# EAGLE design TCC modulo de automação Wifi Rev.1   (EAGLE 8.2.1)
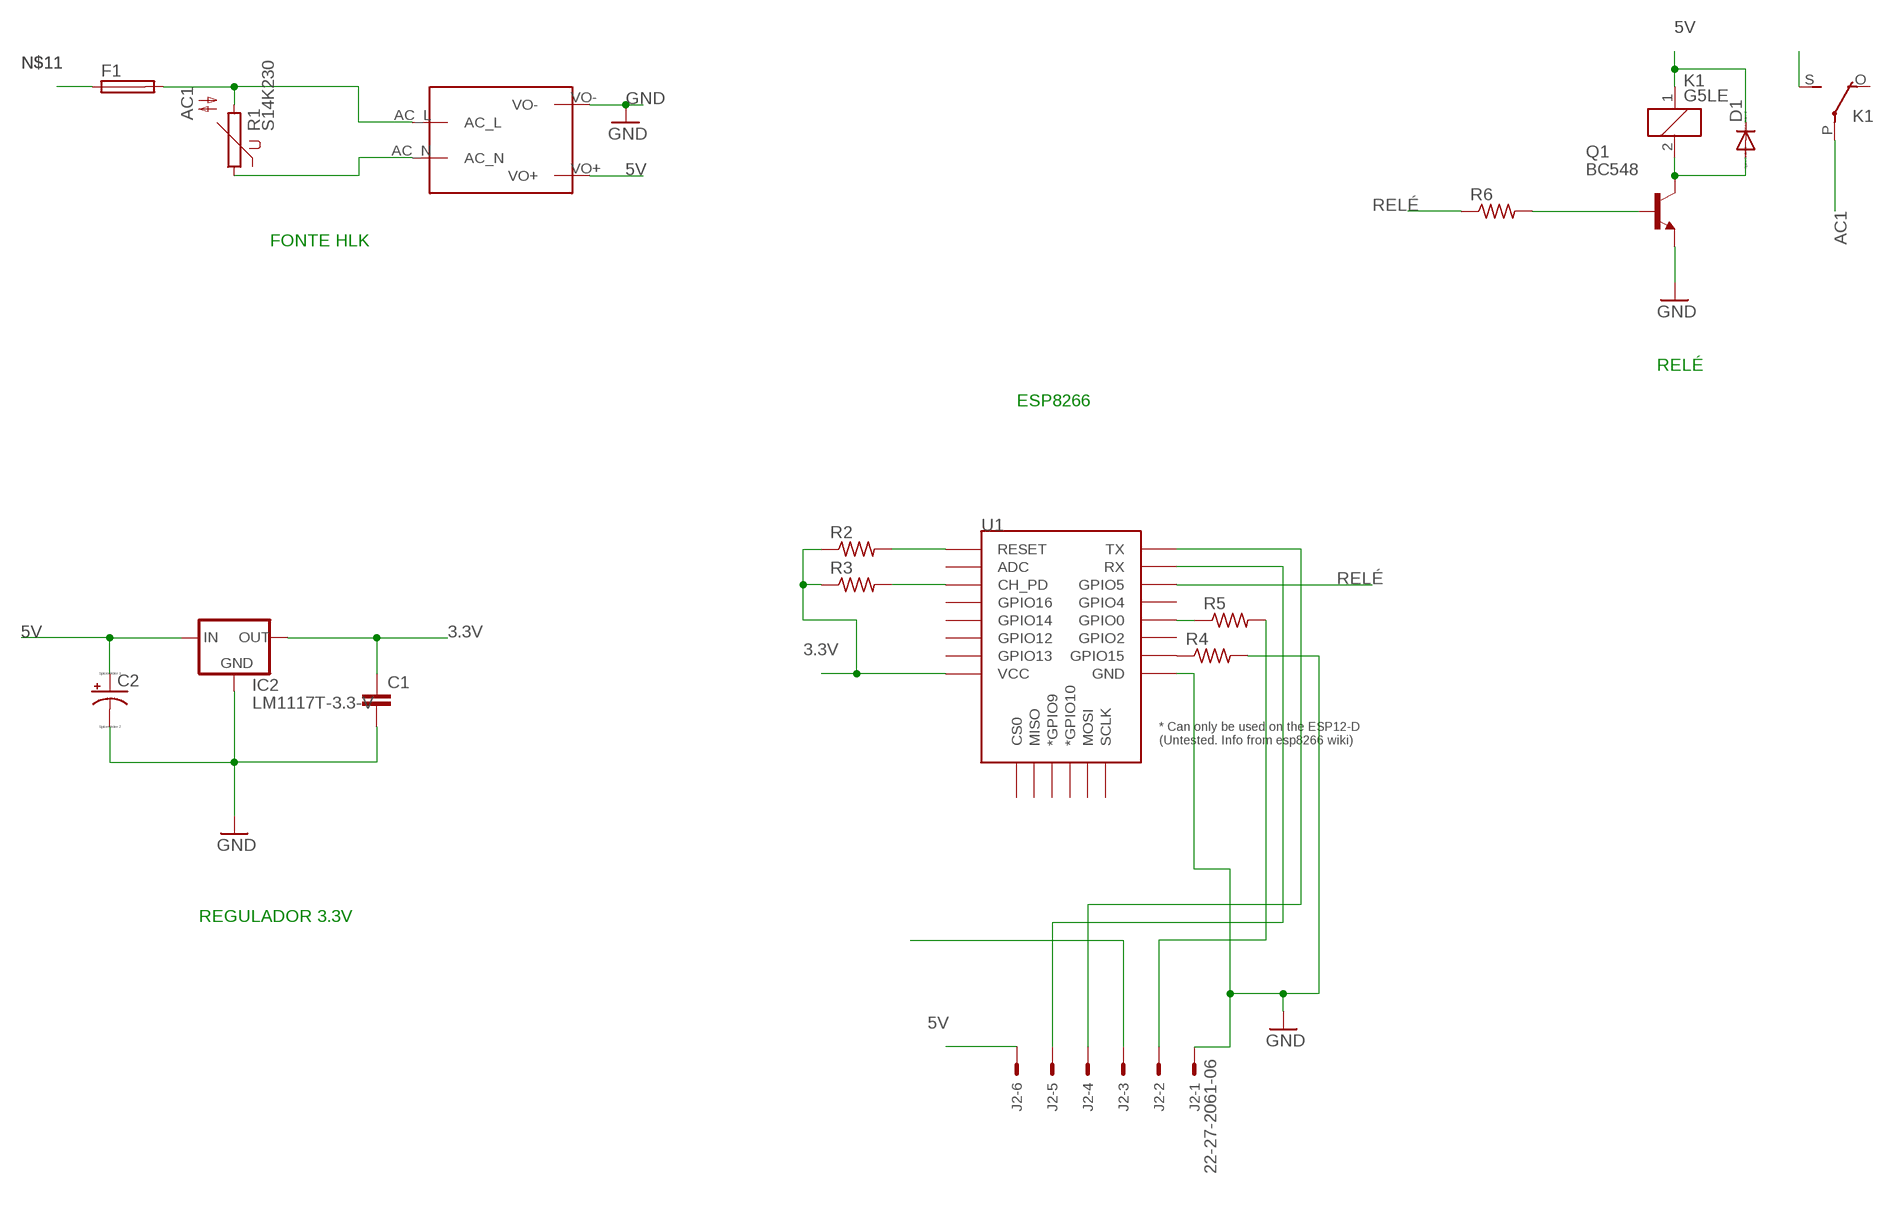
[diagram p0: schematic, sheet 1]

## Parts
C1  C-EU050-025X075  [C050-025X075]
C2  CPOL-USE2-5  [E2-5]
D1  DIODE-SOD106A-R  [SOD106A-R]
F1  GSH15  [GSH15]
IC2  LM1117T-3.3-V  [TO220V]
J2  22-27-2061-06  [6410-06]
K1  G5LE  [G5LE]
Q1  BC548  [TO92-EBC]
R1  S14K230  [S14K230]
R2  R-US_M0805  [M0805]
R3  R-US_M0805  [M0805]
R4  R-US_M0805  [M0805]
R5  R-US_M0805  [M0805]
R6  R-US_M1206  [M1206]
U1  ESP12ESMD  [ESP12E-SMD]
U$2  MAINS_CONVERTERS  [HLK-PM01]

## Nets
3.3V: C1.1 IC2.2(OUT) R2.1 R3.1 U1.VCC
5V: C2.+ D1.C IC2.3(IN) J2.6 K1.1 U$2.VO+
787: R1.1 U$2.AC_N
AC1: F1.2 K1.P(2:P) R1.2 U$2.AC_L
GND: C1.2 C2.- IC2.1(GND) J2.1 Q1.E R4.2 U1.GND U$2.VO-
N$1: R5.1 U1.GPIO0
N$2: R4.1 U1.GPIO15
N$3: Q1.B R6.2
N$4: D1.A K1.2 Q1.C
N$5: R2.2 U1.RESET
N$6: J2.2 R5.2
N$7: J2.4 U1.TXD0(TX)
N$8: J2.5 U1.RXD0(RX)
N$9: J2.3
N$10: R3.2 U1.CH_PD
N$11: F1.1
N$12: K1.S(2:S)
RELÉ: R6.1 U1.GPIO5
Unconnected: K1.O(2:O) U1.ADC U1.CS0 U1.GPIO2 U1.GPIO4 U1.GPIO9(*GPIO9) U1.GPIO10(*GPIO10) U1.GPIO12 U1.GPIO13 U1.GPIO14 U1.GPIO16 U1.MISO U1.MOSI U1.SCLK

## Notes on the sheet
- FONTE HLK
- RELÉ
- ESP8266
- REGULADOR 3.3V

## Library data of the parts
C1 = resistor:C-EU: CAPACITOR, European symbol
C2 = resistor:CPOL-US: POLARIZED CAPACITOR, American symbol
D1 = diode:DIODE-: DIODE
F1 = fuse:GSH15: FUSE HOLDER grid 15mm, 19649 Wickmann; MPN: 64900001039; OC_FARNELL: 1271673; OC_NEWARK: 02P0318
IC2 = lm1117:LM1117T-*
J2 = con-molex:22-?-06: CONNECTOR wire to board 2.54 mm (.1 inch) pitch header; OC_FARNELL: unknown; OC_NEWARK: unknown
K1 = relay:G5LE: RELAY 1 x switch, 10 A/120 V AC, 8 A/30 V DC, Omron; OC_FARNELL: unknown; OC_NEWARK: unknown
Q1 = transistor-npn:BC548*: NPN Transistor
R1 = varistor:S14K230: VARISTOR
R2-R6 = resistor:R-US_: RESISTOR, American symbol
U1 = esp8266modules:ESP12E: ESP12E Module
U$2 = TCC roubado :MAINS_CONVERTERS

## Board
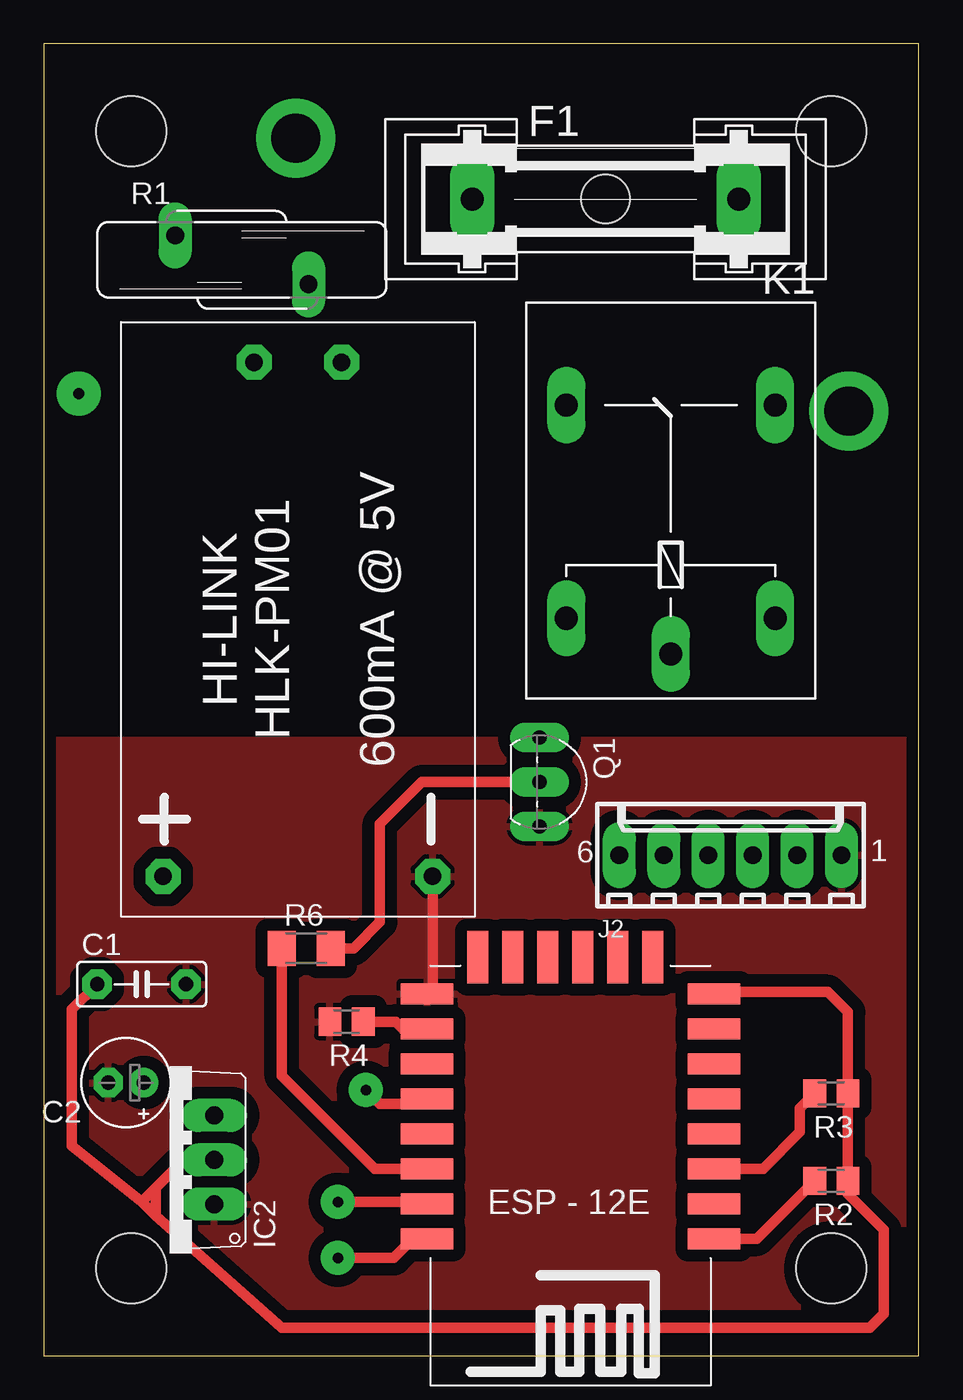
[diagram p1: board, top side]
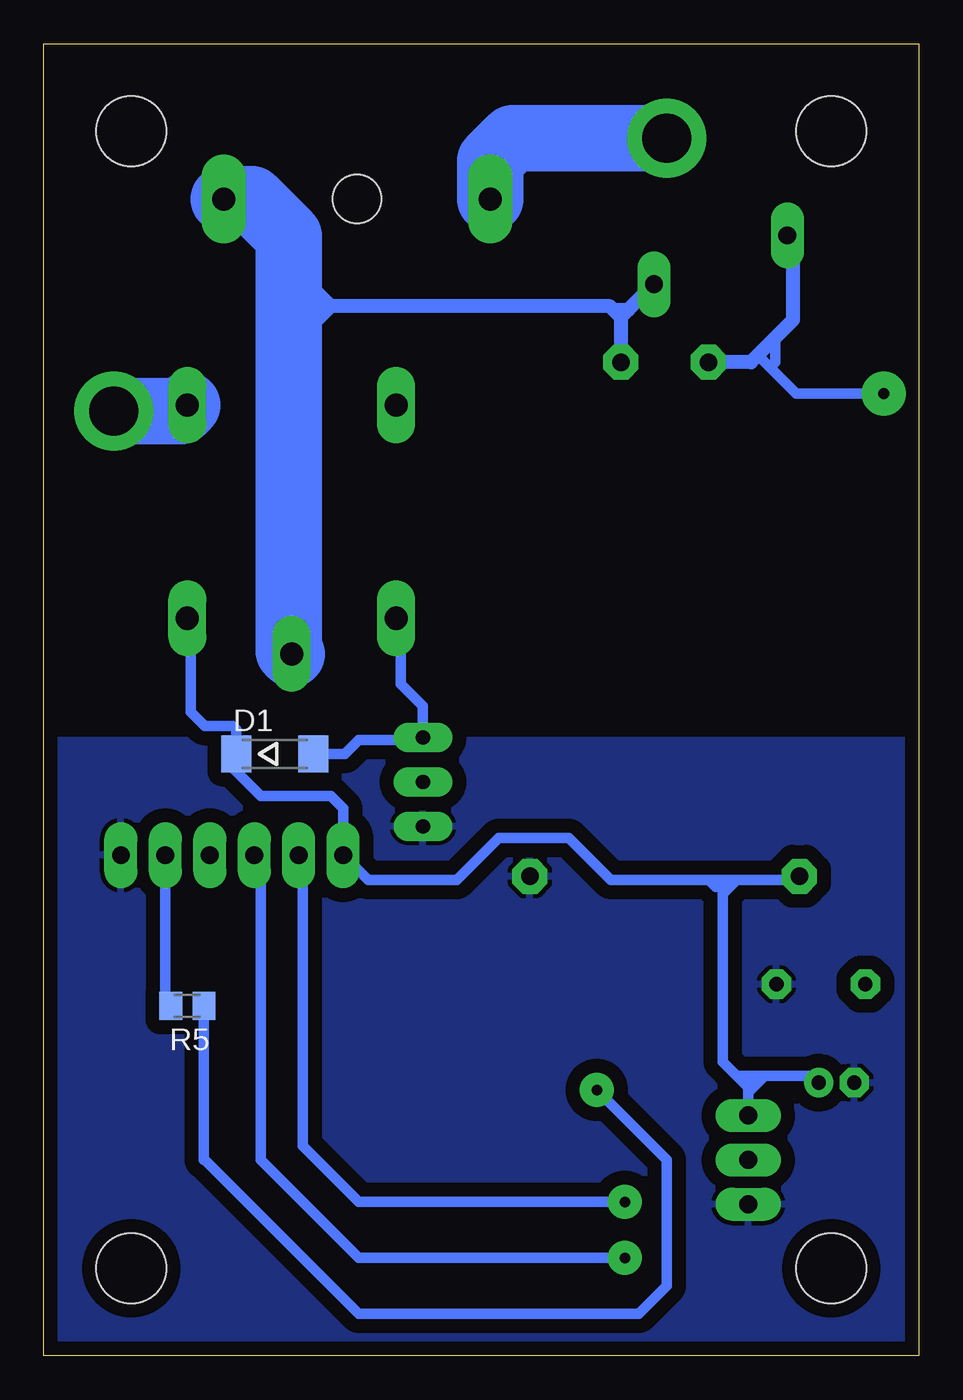
[diagram p2: board, bottom side, seen from below]

Size 50 x 75 mm. Coordinates in mm from the lower left corner, seen from the top.
Outline: 0,0 50,0 50,75 0,75 0,0
Copper layers (1*16): Top 0.035mm / dielectric 1.5mm / Bottom 0.035mm
Design rules "default *": minimum track width 10mil, minimum drill 24mil, track to track 20mil, track to pad 20mil, pad to pad 8mil, via to via 8mil, smd to smd 8mil, copper to edge 10mil, drill to drill 8mil, minimum pad ring 17mil, minimum via ring 14mil, stop-mask expansion 4mil, vias tented up to drill 0mil, thermal gap 10mil
Holes 4 mm at 5,5 45,5 45,70 5,70

### Footprints (pad centres in the part's own frame; a part is rotated, then mirrored left to right if it is on the bottom)
C050-025X075 = drill 0.813 octagon: 1 -2.54,0; 2 2.54,0
E2-5 = drill 0.813 pad 1.27: + -1.016,0 | drill 0.813 pad 1.27 octagon: - 1.016,0
SOD106A-R = smd 1.7 x 2.1: A 2.2,0; C -2.2,0
GSH15 = drill 1.321 pad 2.54 long: 1 -7.62,0; 2 7.62,0 | hole 2.794: 0,0
TO220V = drill 1.016 long: 1 -2.54,-2.54; 2 0,-2.54; 3 2.54,-2.54
6410-06 = drill 1.016 long: 1 6.35,0; 2 3.81,0; 3 1.27,0; 4 -1.27,0; 5 -3.81,0; 6 -6.35,0
G5LE = drill 1.321 long: 1 -7.493,-5.969; 2 -7.493,5.969; O 4.699,5.969; P -9.525,0; S 4.699,-5.969
TO92-EBC = drill 0.813 long: B 0,-1.27; C -2.54,-1.27; E 2.54,-1.27
S14K230 = drill 1.016 long: 1 -1.397,-3.81; 2 1.397,3.81
M0805 = smd 1.3 x 1.6: 1 -0.95,0; 2 0.95,0
M1206 = smd 1.6 x 2: 1 -1.4,0; 2 1.4,0
ESP12E-SMD = smd 3 x 1.2: ADC -8.3,3.8; CH_PD -8.3,1.8; GND 8.1,-8.2; GPIO0 8.1,-2.2; GPIO2 8.1,-4.2; GPIO4 8.1,-0.2; GPIO5 8.1,1.8; GPIO12 -8.3,-4.2; GPIO13 -8.3,-6.2; GPIO14 -8.3,-2.2; GPIO15 8.1,-6.2; GPIO16 -8.3,-0.2; RESET -8.3,5.8; RXD0 8.1,3.8; TXD0 8.1,5.8; VCC -8.3,-8.2 | smd 1.2 x 3: CS0 -4.8,-10.3; GPIO9 -0.8,-10.3; GPIO10 1.2,-10.3; MISO -2.8,-10.3; MOSI 3.2,-10.3; SCLK 5.2,-10.3
HLK-PM01 = drill 1 pad 2 octagon: AC_L -14.7,2.5; AC_N -14.7,-2.5; VO+ 14.7,-7.7; VO- 14.7,7.7

### Placement (x,y rotation side)
C1  5.59,21.24 0 top
C2  4.7,15.61 180 top
D1  36.8,34.4 0 bottom
F1  32.1,66.12 0 top
IC2  7.2,11.2 90 top
J2  39.24,28.62 0 top
K1  35.83,49.65 90 top
Q1  29.6,32.8 270 top
R1  11.32,62.65 270 top
R2  45,10 180 top
R3  45,15 180 top
R4  17.3,19.1 180 top
R5  41.8,20 180 bottom
R6  15,23.3 0 top
U1  30,12.5 180 top
U$2  14.52,42.1 270 top

### Tracks (layer width: path | path; a pad name or v marks a point on that pad's centre or on a via)
3.3V
  Top 0.254: 45.95,10.06 R2.1 | 45.95,14.86 R3.1
  Top 0.61: 45.95,10.06 R3.1 45.95,19.65 44.8,20.8 38.4,20.8 U1.VCC | R2.1 45.95,9.25 48,7.2 48,2.4 47.2,1.6 13.6,1.6 6.4,8 | C1.1 1.6,19.79 1.6,12 5.6,8.8 | 6.4,8 5.6,8.8 | 5.6,8.8 6.4,9.6 | 6.4,9.6 8,11.2 IC2.2 | 6.4,9.6 6.4,8
5V
  Bottom 0.254: J2.6 32.69,28.8
  Bottom 0.61: K1.1 41.6,41.96 41.6,36.8 40.8,36 39.2,36 39,35.8 D1.C 39.2,34.2 39.2,33.6 37.6,32 33.6,32 32.89,31.29 J2.6 31.47,27.2 26.4,27.2 24,29.6 20,29.6 17.6,27.2 12,27.2 | IC2.3 9.74,15.06 | 9.74,15.06 8.8,16 | 8.8,16 6.11,16 C2.+ | 9.74,15.06 9.74,15.34 10.4,16 | 10.8,26.8 11.2,26.4 11.2,16.8 10.4,16 | 10.8,26.8 10.4,27.2 | 10.4,27.2 7.02,27.2 U$2.VO+ | 10.8,26.8 11.6,26.8 12,27.2 | 10.4,27.2 12,27.2 | 9.6,16 8.8,16 | 9.6,16 10.4,16 | 9.74,15.06 9.74,15.86 9.6,16
787  (via drill 0.65 pad 2.5)
  Bottom 0.61: v2,55 7,55 8.5,56.5 | 8.5,56.5 9.2,57.2 | 8.2,58.2 8.2,56.8 8.5,56.5
  Bottom 0.813: R1.1 7.2,63.74 7.2,59.2 8.2,58.2 9.2,57.2 9.6,56.8 U$2.AC_N
AC1
  Bottom 0.813: 16.59,59.79 R1.2 | 16.59,59.79 17.02,59.36 | 17.02,59.36 U$2.AC_L | 17.02,59.36 17.66,60 | 17.66,60 33.6,60 | 33.6,60 36,60 | 17.66,60 17.45,59.79 16.59,59.79 | 33.6,60 34.4,59.2 35.2,59.2 36,58.4 | 33.6,60 36,62.4
  Bottom 3.81: K1.P 36,40.3 36,58.4 36,60 36,62.4 36,64 38.12,66.12 F1.2
GND
  Top 0.254: U1.GND 21.95,20.8
  Top 0.61: U$2.VO- 22.22,21.02 U1.GND
  pour Bottom (isolate 0.8): 0,35.2 0,0 50.4,0 50.4,35.2
  pour Top (isolate 0.7): 0,35.2 50.4,35.2 50,0 0,0
N$1  (via drill 0.6 pad 1.93)
  Top 0.61: v18.4,15.2 19.2,14.4 21.6,14.4 U1.GPIO0
  Bottom 0.61: v18.4,15.2 14.4,11.2 14.4,4 16,2.4 32,2.4 40.8,11.2 40.85,11.2 R5.1
N$2
  Top 0.61: R4.1 20.1,19.1 20.8,18.4 21.6,18.4 U1.GPIO15
N$3
  Top 0.61: R6.2 17.7,23.3 19.2,24.8 19.2,30.4 21.6,32.8 Q1.B | Q1.B 28.8,32.8 Q1.B
N$4
  Bottom 0.61: K1.2 29.6,41.9 29.6,38.4 28.33,37.13 Q1.C 28.19,35.2 32,35.2 32.8,34.4 D1.A
N$5
  Top 0.61: U1.RESET 40.75,6.7 R2.2
N$6
  Bottom 0.61: R5.2 43.05,20 J2.2
N$7  (via drill 0.6 pad 1.93)
  Top 0.254: 22.63,6.86 21.95,6.86 U1.TXD0
  Top 0.61: v16.8,5.6 20,5.6 20.8,6.4 21.6,6.4 U1.TXD0
  Bottom 0.61: v16.8,5.6 32,5.6 37.6,11.2 37.6,28.25 J2.4
N$8  (via drill 0.6 pad 1.93)
  Top 0.254: 22.86,8.91 21.95,8.91 U1.RXD0
  Top 0.61: v16.8,8.8 21.8,8.8 U1.RXD0
  Bottom 0.61: v16.8,8.8 32,8.8 35.2,12 35.2,28.39 J2.5
N$10
  Top 0.254: 39.09,10.74 38.41,10.74 U1.CH_PD | R3.2 43.89,14.86
  Top 0.61: U1.CH_PD 41.1,10.7 43.2,12.8 43.2,14.15 R3.2
N$11  (via drill 2.8 pad 4.5)
  Bottom 3.81: v14.4,69.6 23.2,69.6 24.48,68.32 F1.1
N$12  (via drill 2.8 pad 4.5)
  Bottom 3.81: K1.S 42.15,54 v46,54
RELÉ
  Top 0.61: U1.GPIO5 18.9,10.7 13.6,16 R6.1